# EAGLE design ssr_board (EAGLE 6.6.0)
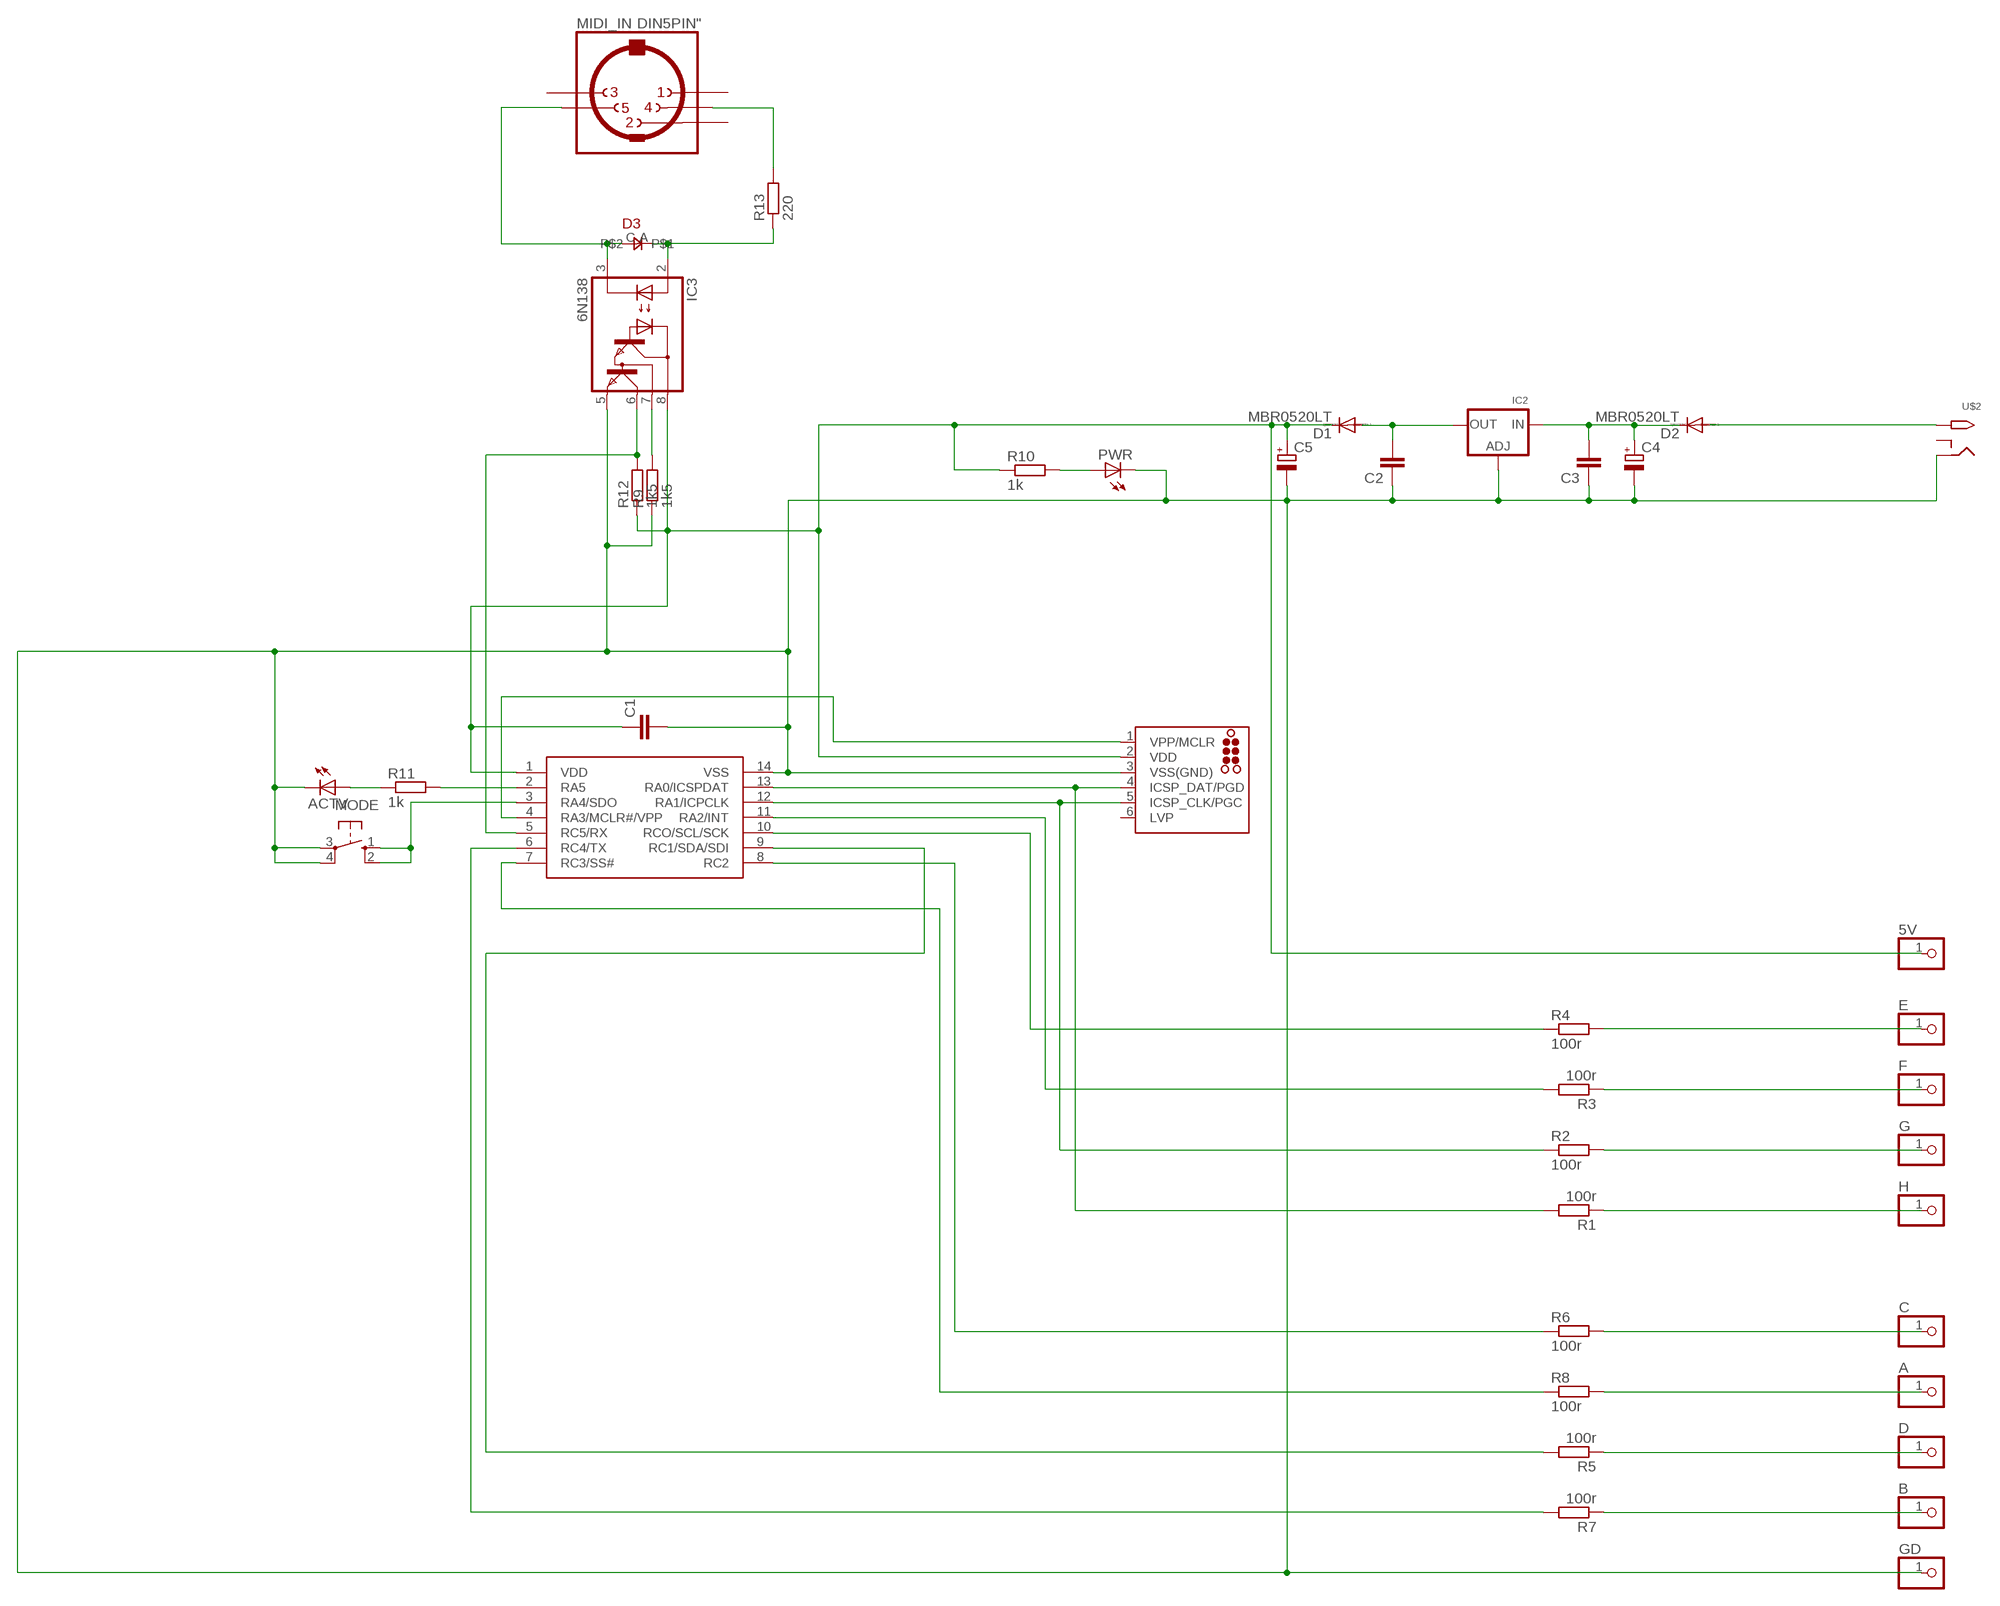
[diagram p0: schematic, sheet 1]

## Parts
5V  PINHD-1X1  [1X01]
A  PINHD-1X1  [1X01]
ACTV  LED3MM  [LED3MM]
B  PINHD-1X1  [1X01]
C  PINHD-1X1  [1X01]
C1  C-EUC0805  [C0805]
C2  C-EUC0805  [C0805]
C3  C-EUC0805  [C0805]
C4  CPOL-EUE2-5  [E2-5]
C5  CPOL-EUE2-5  [E2-5]
D  PINHD-1X1  [1X01]
D1  MBR0520LT  [SOD123]
D2  MBR0520LT  [SOD123]
D3  0805DIODE  [0805DIODE]
E  PINHD-1X1  [1X01]
F  PINHD-1X1  [1X01]
G  PINHD-1X1  [1X01]
GD  PINHD-1X1  [1X01]
H  PINHD-1X1  [1X01]
IC1  PIC16F1825SO14  [SO14]
IC2  LM1117SOT223-WAVE  [SOT223-W]
IC3  6N138  [DIL08]
ICSP  TC2030-MCP-NL  [TC2030-MCP-NL]
MIDI_IN  DIN5PIN"  [TRUCONN90]
MODE  10-XX  [B3F-10XX]
PWR  LED3MM  [LED3MM]
R1  100r  R-EU_R0805  [R0805]
R2  100r  R-EU_R0805  [R0805]
R3  100r  R-EU_R0805  [R0805]
R4  100r  R-EU_R0805  [R0805]
R5  100r  R-EU_R0805  [R0805]
R6  100r  R-EU_R0805  [R0805]
R7  100r  R-EU_R0805  [R0805]
R8  100r  R-EU_R0805  [R0805]
R9  1k5  R-EU_R0805  [R0805]
R10  1k  R-EU_R0805  [R0805]
R11  1k  R-EU_R0805  [R0805]
R12  1k5  R-EU_R0805  [R0805]
R13  220  R-EU_R0805  [R0805]
U$2  2.1MMJACKTHM  [PJ-102A]

## Nets
5V: 5V.1 C1.1 C5.+ D1.C IC1.1(VDD) IC3.8(VCC) ICSP.2(VDD) R10.1 R12.1
GND: ACTV.K(C) C1.2 C2.1 C3.1 C4.- C5.- GD.1 IC1.14(VSS) IC2.1(ADJ) IC3.5(GND) ICSP.3(VSS(GND)) MODE.3(P) MODE.4(P1) PWR.K(C) R9.1 U$2.RING
N$2: C2.2 D1.A IC2.2(OUT)
N$3: D2.A U$2.TIP
N$4: PWR.A R10.2
N$5: C3.2 C4.+ D2.C IC2.3(IN)
N$9: MIDI_IN.4 R13.2
N$10: D3.A IC3.2(A) R13.1
N$11: D3.C IC3.3(C) MIDI_IN.5
N$12: IC3.7(VB) R9.2
N$14: F.1 R3.1
N$15: G.1 R2.2
N$16: H.1 R1.1
N$17: C.1 R6.2
N$18: A.1 R8.2
N$19: D.1 R5.1
N$20: B.1 R7.1
N$21: IC1.12(RA1/ICPCLK) ICSP.5(ICSP_CLK/PGC) R2.1
N$22: IC1.13(RA0/ICSPDAT) ICSP.4(ICSP_DAT/PGD) R1.2
N$23: IC1.8(RC2) R6.1
N$24: IC1.7(RC3/SS#) R8.1
N$25: IC1.9(RC1/SDA/SDI) R5.2
N$26: IC1.6(RC4/TX) R7.2
N$27: E.1 R4.2
N$35: IC1.4(RA3/MCLR#/VPP) ICSP.1(VPP/MCLR)
N$45: IC1.3(RA4/SDO) MODE.1(S) MODE.2(S1)
N$46: IC1.11(RA2/INT) R3.2
N$47: IC1.10(RCO/SCL/SCK) R4.1
N$48: IC1.5(RC5/RX) IC3.6(VO) R12.2
N$49: ACTV.A R11.1
N$50: IC1.2(RA5) R11.2
Unconnected: ICSP.6(LVP) MIDI_IN.1 MIDI_IN.2 MIDI_IN.3 U$2.RING_SW

## Library data of the parts
5V A B C D E F G GD H = adafruit:PINHD-1X1: Pin header 1x1 for 0.1" spacing With round pins
ACTV PWR = led:LED: LED OSRAM: - CHIPLED LG R971, LG N971, LY N971, LG Q971, LY Q971, LO R971, LY R971 LH N974, LH R974 LS Q976, LO Q976, LY Q976 LO Q996 - Hyper CHIPLED LW Q18S LB Q993, LB Q99A, LB R99A - SideLED LS A670, LO A670, LY A670, LG A670, LP A670 LB A673, LV A673, LT A673, LW A673 LH A674 LY A675 LS A676, LA A676, LO A676, LY A676, LW A676 LS A679, LY A679, LG A679 - Hyper Micro SIDELED® LS Y876, LA Y876, LO Y876, LY Y876 LT Y87S - SmartLED LW L88C, LW L88S LB L89C, LB L89S, LG L890 LS L89K, LO L89K, LY L89K LS L896, LA L896, LO L896, LY L896 - TOPLED LS T670, LO T670, LY T670, LG T670, LP T670 LSG T670, LSP T670, LSY T670, LOP T670, LYG T670 LG T671, LOG T671, LSG T671 LB T673, LV T673, LT T673, LW T673 LH T674 LS T676, LA T676, LO T676, LY T676, LB T676, LH T676, LSB T676, LW T676 LB T67C, LV T67C, LT T67C, LS T67K, LO T67K, LY T67K, LW E67C LS E67B, LA E67B, LO E67B, LY E67B, LB E67C, LV E67C, LT E67C LW T67C LS T679, LY T679, LG T679 LS T770, LO T770, LY T770, LG T770, LP T770 LB T773, LV T773, LT T773, LW T773 LH T774 LS E675, LA E675, LY E675, LS T675 LS T776, LA T776, LO T776, LY T776, LB T776 LHGB T686 LT T68C, LB T68C - Hyper Mini TOPLED® LB M676 - Mini TOPLED Santana® LG M470 LS M47K, LO M47K, LY M47K Source: http://www.osram.convergy.de LUXEON: - LUMILED® LXK2-PW12-R00, LXK2-PW12-S00, LXK2-PW14-U00, LXK2-PW14-V00 LXK2-PM12-R00, LXK2-PM12-S00, LXK2-PM14-U00 LXK2-PE12-Q00, LXK2-PE12-R00, LXK2-PE12-S00, LXK2-PE14-T00, LXK2-PE14-U00 LXK2-PB12-K00, LXK2-PB12-L00, LXK2-PB12-M00, LXK2-PB14-N00, LXK2-PB14-P00, LXK2-PB14-Q00 LXK2-PR12-L00, LXK2-PR12-M00, LXK2-PR14-Q00, LXK2-PR14-R00 LXK2-PD12-Q00, LXK2-PD12-R00, LXK2-PD12-S00 LXK2-PH12-R00, LXK2-PH12-S00 LXK2-PL12-P00, LXK2-PL12-Q00, LXK2-PL12-R00 Source: www.luxeon.com KINGBRIGHT: KA-3528ASYC Source: www.kingbright.com
C1-C3 = rcl:C-EU: CAPACITOR, European symbol
C4 C5 = rcl:CPOL-EU: POLARIZED CAPACITOR, European symbol
D1 D2 = diode:MBR0520LT: SCHOTTKY BARRIER RECTIFIER Source: http://onsemi.com .. MBR0520LT1-D.pdf
D3 = jasons_stuff:0805DIODE
IC1 = jasons_stuff:PIC16F1825
IC2 = microbuilder:LM1117: LM1117 Voltage Regulator LM1117 Adjustable Voltage regulator [Digikey: LM1117IMP-ADJDKR-ND] LM1117 3.3V Voltage regulator [AP1117E33GDIDKR-ND] LM1117 5.0V Voltage regulator [AP1117E50GDIDKR-ND] SOT223-REFLOW - SOT223 package for solder paste/reflow ovens SOT223-WAVE - SOT223 package for hand-soldering (larger pads) Note: For the fixed-voltage regulators, simply set the ADJ pin to GND.
IC3 = optocoupler:6N138: MOTOROLA OPTO COUPLER
ICSP = tag-connect:TC2030: TAG-CONNECT ICSP Connector Manufacturer: Tag-Connect <http://www.tag-connect.com> Cable for easy In-Circuit Serial Programming. Designed for Microchip ICD2, suitable for many others. Two variants - one "with legs" (for hands-free fit on PCB) and another "without legs" for quick programming. PAD Description 1 MCLR/Vpp 2 Vdd 3 GND 4 PGD (ISPDAT) 5 PGC (ISPCLK) 6 nc (used for LVP) ©2009 ROFA.cz - modified and updated by Robert Darlington ‹rdarlington@gmail.com›
MIDI_IN = jasons_stuff:DIN5PIN: Female CONNECTOR 5 pins 90 deg. with shield, horizontal (DIN 41524)
MODE = switch-omron:10-XX: OMRON SWITCH
R1-R13 = rcl:R-EU_: RESISTOR, European symbol
U$2 = adafruit:2.1MMJACK: 2.1mm x 5.5mm THM DC jack with internal switch. Digikey part #PJ-102A, 4UCON part #05537 2.1mm x 5.5mm SMT DC jack with internal switch. Digikey part #PJ-002A-SMT, 4UCON part #03267 By microbuilder.eu & adafruit.com

## Board
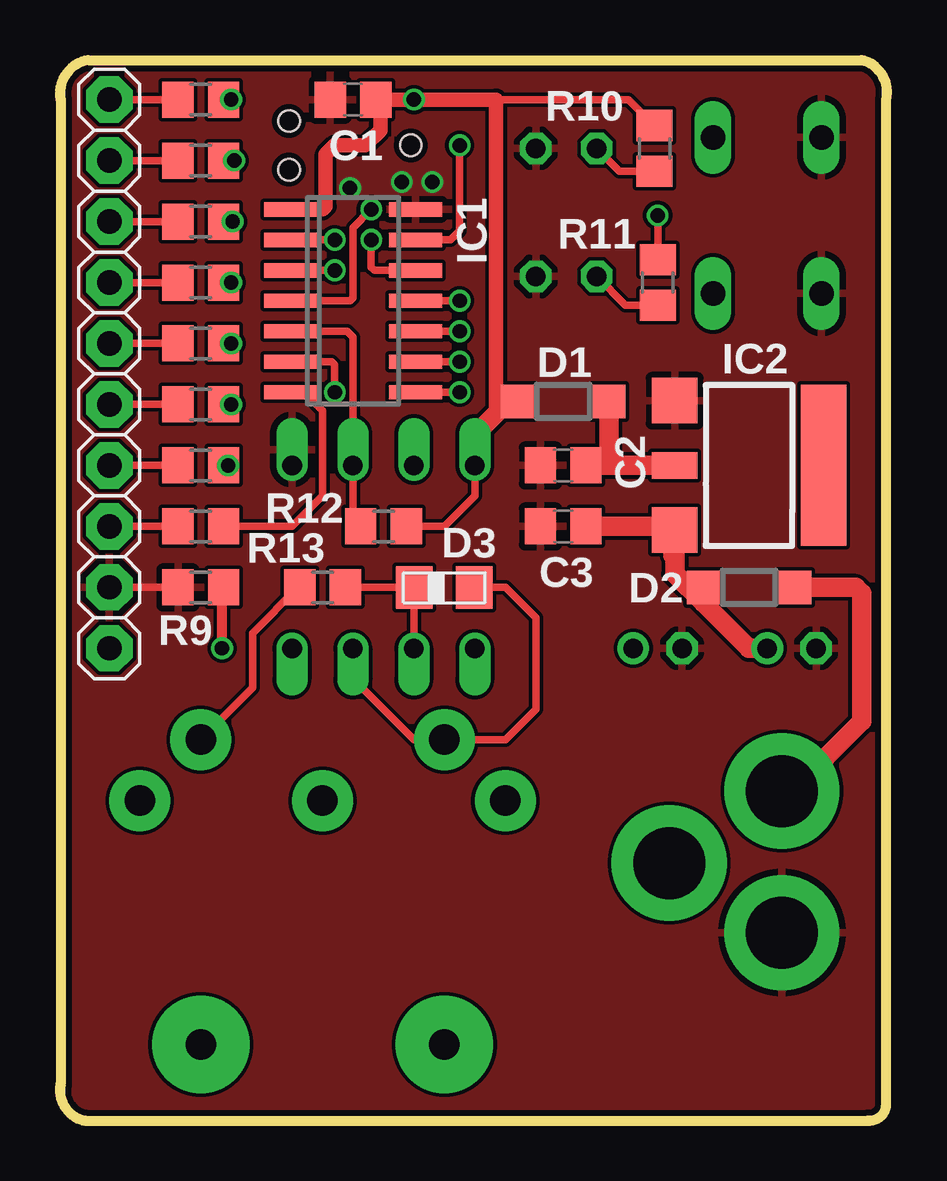
[diagram p1: board, top side]
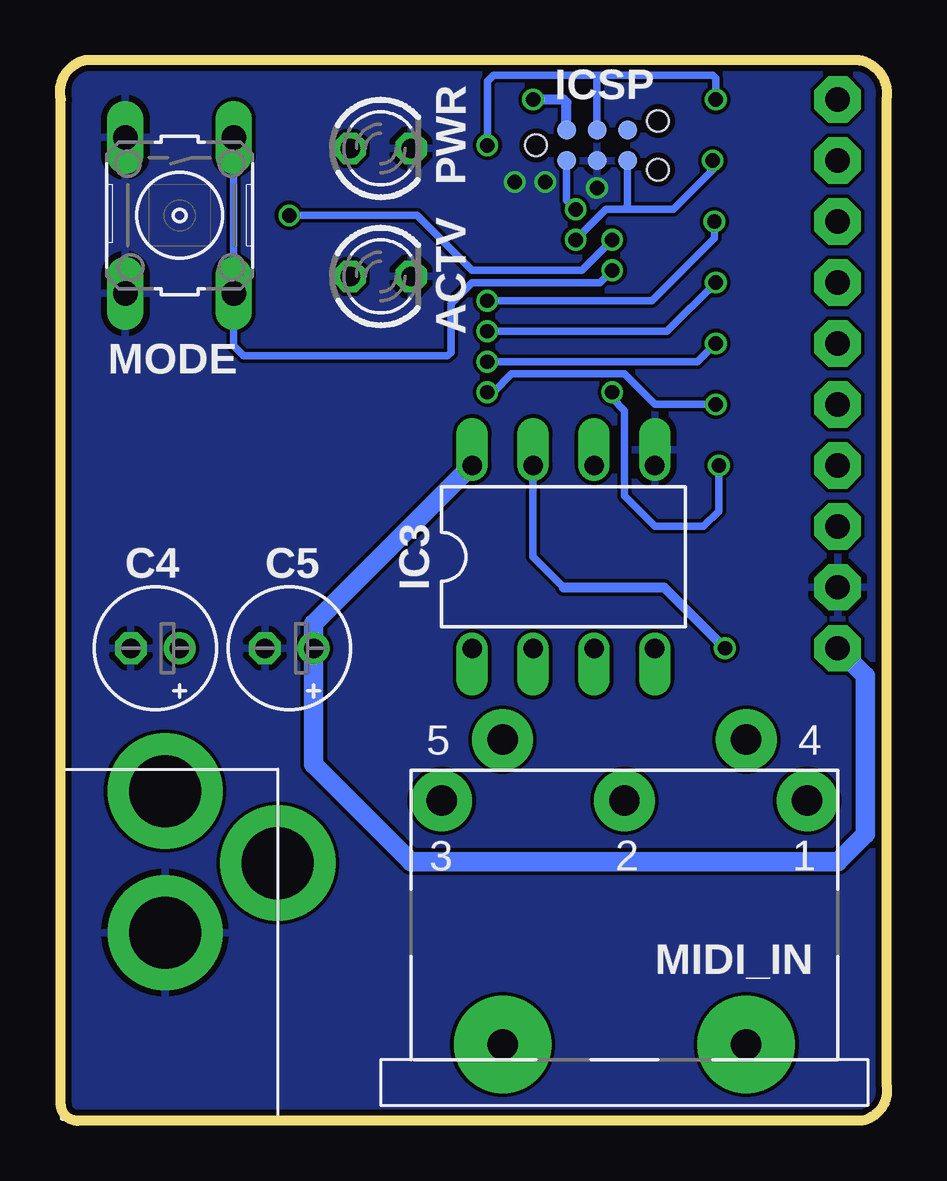
[diagram p2: board, bottom side, seen from below]

Size 34.48 x 44.2 mm. Coordinates in mm from the lower left corner, seen from the top.
Outline: 34.44,0.64 34.44,42.55 arc90 33.43,44.2 1.17,44.2 arc90 0.03,42.55 0.03,1.53 arc90 1.04,0 33.68,0 arc90 34.44,0.64
Copper layers (1*16): Top 0.035mm / dielectric 1.5mm / Bottom 0.035mm
Design rules "ITEADstudio_DRC": minimum track width 6mil, minimum drill 12mil, track to track 6mil, track to pad 6mil, pad to pad 6mil, via to via 6mil, smd to smd 0mil, copper to edge 10mil, drill to drill 10mil, minimum pad ring 10mil, minimum via ring 6mil, stop-mask expansion 2mil, vias tented up to drill 100mil, thermal gap 10mil

### Footprints (pad centres in the part's own frame; a part is rotated, then mirrored left to right if it is on the bottom)
1X01 = drill 1.016 pad 1.93 octagon: 1 0,0
LED3MM = drill 0.813 octagon: A -1.27,0; K 1.27,0
C0805 = smd 1.3 x 1.5: 1 -0.95,0; 2 0.95,0
E2-5 = drill 0.813 pad 1.27: + -1.016,0 | drill 0.813 pad 1.27 octagon: - 1.016,0
SOD123 = smd 1.4 x 1.4: A 1.9,0; C -1.9,0
0805DIODE = smd 1.524 x 1.778: A -1.262,-0.005; C 1.238,-0.005
SO14 = smd 0.6 x 2.2: 1 -3.81,-2.6; 2 -2.54,-2.6; 3 -1.27,-2.6; 4 0,-2.6; 5 1.27,-2.6; 6 2.54,-2.6; 7 3.81,-2.6; 8 3.81,2.6; 9 2.54,2.6; 10 1.27,2.6; 11 0,2.6; 12 -1.27,2.6; 13 -2.54,2.6; 14 -3.81,2.6
SOT223-W = smd 1.9 x 1.9: 1 -2.7,-3.1; 3 2.7,-3.1 | smd 1.1 x 1.9: 2 0,-3.1 | smd 6.7 x 1.9: 4 0,3.1
DIL08 = drill 0.813 offset: 1 -3.81,-3.81; 2 -1.27,-3.81; 3 1.27,-3.81; 4 3.81,-3.81; 5 3.81,3.81; 6 1.27,3.81; 7 -1.27,3.81; 8 -3.81,3.81
TC2030-MCP-NL = smd 0.787 x 0.787: 1 1.27,-0.635; 2 1.27,0.635; 3 2.54,-0.635; 4 2.54,0.635; 5 3.81,-0.635; 6 3.81,0.635 | hole 0.889: 0,0; 5.08,-1.016; 5.08,1.016
TRUCONN90 = drill 1.27 pad 2.54: 1 7.62,5.08; 2 0,5.08; 3 -7.62,5.08; 4 5.08,7.62; 5 -5.08,7.62 | drill 1.27 pad 4.064: NC -5.08,-5.08; NC@ 5.08,-5.08
B3F-10XX = drill 1.016 long: 1 -3.251,2.261; 2 3.251,2.261; 3 -3.251,-2.261; 4 3.251,-2.261
R0805 = smd 1.3 x 1.5: 1 -0.95,0; 2 0.95,0
PJ-102A = drill 3 pad 4.8: RING 0.1,-3.39; RING_SW -4.6,-6.29; TIP 0.1,-9.29

### Placement (x,y rotation side)
5V  2.06,19.69 0 top
A  2.06,24.77 0 top
ACTV  21.11,35.18 0 bottom
B  2.06,27.31 0 top
C  2.06,29.85 0 top
C1  12.22,42.55 180 top
C2  20.98,27.31 0 top
C3  20.98,24.77 0 top
C4  30.51,19.69 180 bottom
C5  24.92,19.69 180 bottom
D  2.06,32.39 0 top
D1  20.98,29.97 0 top
D2  28.73,22.23 0 top
D3  16.03,22.23 0 top
E  2.06,34.93 0 top
F  2.06,37.47 0 top
G  2.06,40.01 0 top
GD  2.06,22.23 0 top
H  2.06,42.55 0 top
IC1  12.22,34.17 270 top
IC2  28.73,27.31 270 top
IC3  13.49,23.5 0 bottom
ICSP  14.63,40.64 0 bottom
MIDI_IN  10.95,8.26 0 bottom
MODE  29.49,37.72 270 bottom
PWR  21.11,40.52 0 bottom
R1  5.87,42.55 0 top
R2  5.87,40.01 180 top
R3  5.87,37.47 0 top
R4  5.87,34.93 180 top
R5  5.87,32.39 0 top
R6  5.87,29.85 180 top
R7  5.87,27.31 0 top
R8  5.87,24.77 180 top
R9  5.87,22.23 0 top
R10  24.79,40.52 270 top
R11  24.92,34.93 90 top
R12  13.49,24.77 180 top
R13  10.95,22.23 180 top
U$2  30,4.45 180 bottom

### Tracks (layer width: path | path; a pad name or v marks a point on that pad's centre or on a via)
5V  (via drill 0.6)
  Top 0.305: R12.1 16.03,24.77 17.3,26.04 IC3.8 | 18.19,42.55 23.71,42.55 R10.1
  Top 0.61: 17.3,28.07 17.3,28.58 18.19,29.47 18.19,42.55 v14.76,42.55 C1.1 13.36,42.35 ICSP.2 12.73,40.64 11.46,40.64 11.07,40.26 11.07,38.1 10.95,37.98 IC1.1
  Top 0.813: 17.3,28.07 IC3.8 17.3,28.58 18.69,29.97 D1.C
  Bottom 0.305: ICSP.2 13.49,41.28
  Bottom 0.406: 14.63,42.55 v14.76,42.55 13.49,42.55 13.36,42.42 ICSP.2
  Bottom 0.813: 5V.1 0.91,18.54 0.91,11.94 2.06,10.8 19.84,10.8 23.9,14.86 C5.+ 23.9,20.7 IC3.8
GND  (via drill 0.6)
  Top 0.305: GD.1 R9.1
  other vias: 12.09,38.86 14.25,39.12 15.52,39.12
  pour Bottom: -4.29,46.36 -4.29,-1.9 37.62,-1.9 37.62,47.63 -4.29,47.63
  pour Top: -3.02,45.09 -3.02,-1.9 37.62,-1.9 37.62,47.63 -3.02,47.63
N$2
  Top 0.813: 22.89,27.31 IC2.2 | C2.2 22.89,27.31 | 22.89,27.31 D1.A
N$3
  Top 0.813: U$2.TIP 30.52,13.74 33.43,16.64 33.43,21.97 33.17,22.23 D2.A
N$4
  Top 0.305: R10.2 23.33,39.57 PWR.A
N$5
  Top 0.813: 25.63,23.5 IC2.3 25.47,24.77 C3.2 | 25.63,23.5 25.63,22.79 26.19,22.23 | 26.19,22.23 D2.C 26.83,21.59 | 25.56,23.56 25.63,23.5 | C4.+ 28.73,19.69 26.19,22.23
N$9
  Top 0.305: R13.2 9.93,22.23 8.03,20.32 8.03,18.04 MIDI_IN.4
N$10
  Top 0.305: IC3.2 D3.A R13.1
N$11
  Top 0.305: IC3.3 12.22,18.42 14.76,15.88 MIDI_IN.5 18.57,15.88 19.84,17.15 19.84,20.96 18.57,22.22 D3.C
N$12  (via drill 0.6)
  Top 0.406: v6.76,19.69 6.76,22.17 R9.2
  Bottom 0.305: 13.49,22.23 14.76,23.5 IC3.7
  Bottom 0.406: 13.49,22.23 9.3,22.23 v6.76,19.69
N$14
  Top 0.305: F.1 R3.1
N$15
  Top 0.305: G.1 R2.2
N$16
  Top 0.305: H.1 R1.1
N$17
  Top 0.305: C.1 R6.2
N$18
  Top 0.305: A.1 R8.2
N$19
  Top 0.305: D.1 R5.1
N$20
  Top 0.305: B.1 R7.1
N$21  (via drill 0.6)
  Top 0.305: R2.1 v7.26,40.01 | IC1.12 13.11,35.44 12.98,35.56 v12.98,36.71
  Bottom 0.305: v7.26,40.01 7.26,39.63 8.92,37.98 10.95,37.98 | 10.95,37.98 11.71,37.98 v12.98,36.71 | ICSP.5 10.82,38.1 10.95,37.98
N$22  (via drill 0.6)
  Top 0.305: R1.2 v7.14,42.55 | v16.66,40.64 16.66,37.09 16.28,36.71 IC1.13
  Bottom 0.305: v7.14,42.55 7.14,43.44 7.26,43.56 12.09,43.56 | 12.09,43.56 16.41,43.56 16.66,43.31 v16.66,40.64 | ICSP.4 12.09,43.56
N$23  (via drill 0.6)
  Top 0.305: R6.1 v7.14,29.85 | IC1.8 v16.66,30.36
  Bottom 0.305: v7.14,29.85 9.68,29.85 10.95,31.12 15.65,31.12 16.41,30.36 v16.66,30.36
N$24
  Top 0.305: R8.1 9.68,24.77 10.95,26.04 10.95,29.59 10.19,30.36 IC1.7
N$25  (via drill 0.6)
  Top 0.305: R5.2 v7.14,32.39 | IC1.9 v16.66,31.63
  Bottom 0.305: v7.14,32.39 7.9,31.63 v16.66,31.63
N$26  (via drill 0.6)
  Top 0.305: R7.2 v7.01,27.31 | IC1.6 11.33,31.63 11.46,31.5 v11.46,30.36
  Bottom 0.305: v7.01,27.31 7.01,25.4 7.65,24.77 9.68,24.77 10.95,26.04 10.95,29.59 11.46,30.1 v11.46,30.36
N$27
  Top 0.305: E.1 R4.2
N$35  (via drill 0.6)
  Top 0.305: IC1.4 12.09,34.17 12.22,34.29 12.22,37.21 v12.98,37.98
  Bottom 0.305: ICSP.1 13.36,38.36 v12.98,37.98
N$45  (via drill 0.6)
  Top 0.305: IC1.3 v11.46,35.44
  Bottom 0.305: v11.46,35.44 11.96,34.93 17.3,34.93 18.19,34.04 18.19,32.01 18.31,31.88 26.82,31.88 27.23,32.29 MODE.2 MODE.1
N$46  (via drill 0.6)
  Top 0.305: IC1.11 v16.66,34.17 | R3.2 v7.2,37.47
  Bottom 0.305: 16.54,34.17 v16.66,34.17 9.8,34.17 7.2,36.77 v7.2,37.47
N$47  (via drill 0.6)
  Top 0.305: R4.1 v7.14,34.93 | IC1.10 v16.66,32.9
  Bottom 0.305: v7.14,34.93 9.17,32.9 v16.66,32.9
N$48
  Top 0.305: R12.2 12.22,25.09 IC3.6 12.22,32.64 11.96,32.9 IC1.5
N$49
  Top 0.305: R11.1 23.58,33.98 ACTV.A
N$50  (via drill 0.6)
  Top 0.305: IC1.2 v11.46,36.71 | v24.92,37.72 R11.2
  Bottom 0.305: v24.92,37.72 19.58,37.72 17.3,35.44 12.73,35.44 v11.46,36.71

### Text on the board
tDocu: SSR MIDI / SWITCHER v1 | six4pix.com
bDocu: CH8 | CH7 | CH6 | CH5 | CH4 | CH3 | CH2 | CH1 | DC- | DC+